# Altium schematic sheet ESP32.SchDoc
size A4
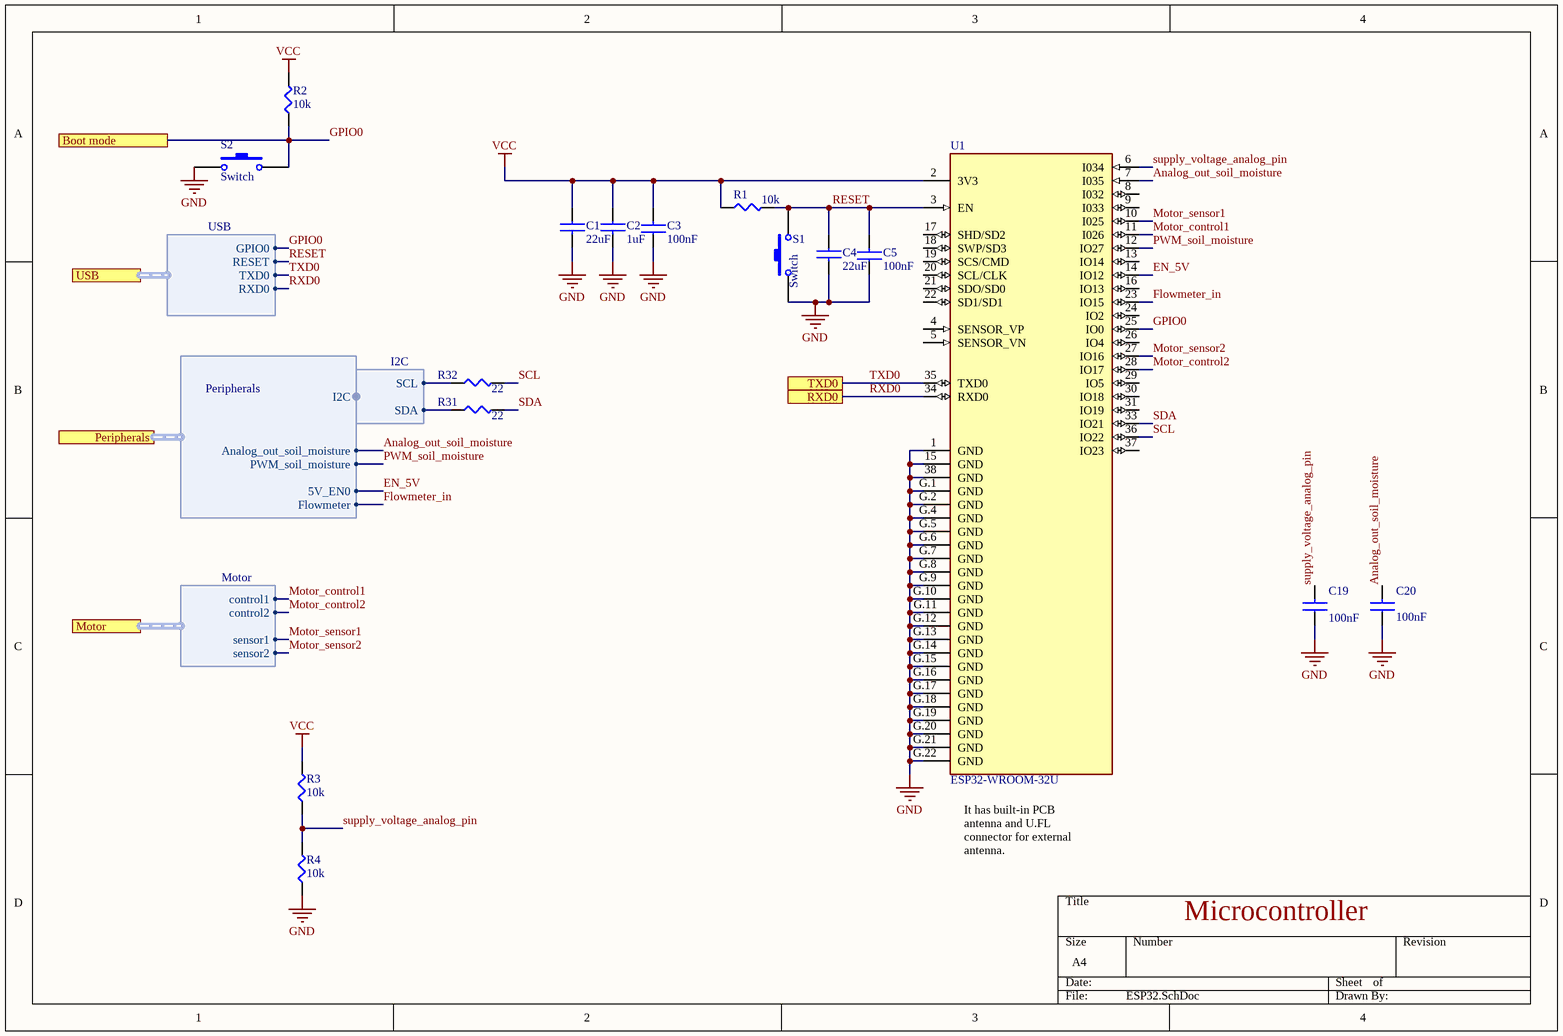
[diagram p0: ESP32.SchDoc]

## Parts
C1  22uF  [CAPC200X125X110L50N]
C2  1uF  [CAPC200X125X110L50N]
C3  100nF  [CAPC160X80X90L35N]
C4  22uF  [CAPC200X125X110L50N]
C5  100nF  [CAPC160X80X90L35N]
C19  100nF  [CAPC160X80X90L35N]
C20  100nF  [CAPC160X80X90L35N]
R1  10k  [RESC200X125X70L40N]
R2  10k  [RESC200X125X70L40N]
R3  10k  [RESC200X125X70L40N]
R4  10k  [RESC200X125X70L40N]
R31  22  [RESC160X80X90L30N]
R32  22  [RESC160X80X90L30N]
S1  Switch  [SKRKAEE020]
S2  Switch  [SKRKAEE020]
U1  ESP32-WROOM-32U  [ESP32-WROOM-32U]

## Ports
Boot mode, Motor (harness Motor), Peripherals (harness Peripherals), RXD0, TXD0, USB (harness USB)

## Harnesses
Motor: control1, control2, sensor1, sensor2
Peripherals: I2C, Analog_out_soil_moisture, PWM_soil_moisture, 5V_EN0, Flowmeter
I2C: SDA, SCL
USB: GPIO0, RESET, TXD0, RXD0

## Nets
GND: C1.2 C2.2 C3.1 C4.2 C5.1 C19.1 C20.1 R4.1 S1.1 S2.2 U1.1(GND) U1.15(GND) U1.38(GND) U1.G.1(GND) U1.G.2(GND) U1.G.4(GND) U1.G.5(GND) U1.G.6(GND) U1.G.7(GND) U1.G.8(GND) U1.G.9(GND) U1.G.10(GND) U1.G.11(GND) U1.G.12(GND) U1.G.13(GND) U1.G.14(GND) U1.G.15(GND) U1.G.16(GND) U1.G.17(GND) U1.G.18(GND) U1.G.19(GND) U1.G.20(GND) U1.G.21(GND) U1.G.22(GND)
VCC: C1.1 C2.1 C3.2 R1.1 R2.2 R3.2 U1.2(3V3)
Analog_out_soil_moisture: C20.2 U1.7(I035) ; port Peripherals.Analog_out_soil_moisture
EN_5V: U1.14(IO12) ; port Peripherals.5V_EN0
Flowmeter_in: U1.23(IO15) ; port Peripherals.Flowmeter
GPIO0: R2.1 S2.1 U1.25(IO0) ; port Boot mode, port USB.GPIO0
Motor_control1: U1.11(I026) ; port Motor.control1
Motor_control2: U1.28(IO17) ; port Motor.control2
Motor_sensor1: U1.10(I025) ; port Motor.sensor1
Motor_sensor2: U1.27(IO16) ; port Motor.sensor2
PWM_soil_moisture: U1.12(IO27) ; port Peripherals.PWM_soil_moisture
RESET: C4.1 C5.2 R1.2 S1.2 U1.3(EN) ; port USB.RESET
RXD0: U1.34(RXD0) ; port RXD0, port USB.RXD0
SCL: R32.2 U1.36(IO22)
SDA: R31.2 U1.33(IO21)
supply_voltage_analog_pin: C19.2 R3.1 R4.2 U1.6(I034)
TXD0: U1.35(TXD0) ; port TXD0, port USB.TXD0
NetR31_1: R31.1 ; harness I2C.SDA
NetR32_1: R32.1 ; harness I2C.SCL

Not connected (* = marked no-connect by the designer): U1 4(SENSOR_VP) 5(SENSOR_VN) 8(I032) 9(I033) 13(IO14) 16(IO13) 17(SHD/SD2) 18(SWP/SD3) 19(SCS/CMD) 20(SCL/CLK) 21(SDO/SD0) 22(SD1/SD1) 24(IO2) 26(IO4) 29(IO5) 30(IO18) 31(IO19) 37(IO23)

## Notes on the sheet
- (near U1) It has built-in PCB antenna and U.FL connector for external antenna.
- Microcontroller

## Library data of the parts
C1-C5 C19 C20 = Capacitor: Part Number: *; Package: *
  C1 C4: Value: 22uF; LCSC Part #: C59461
  C2: Value: 1uF; LCSC Part #: C15849
  C3 C5 C19 C20: Value: 100nF; LCSC Part #: C14663
R1-R4 R31 R32 = Resistor: Part Number: *; Package: *
  R1-R4: Value: 10k; LCSC Part #: C17414
  R31 R32: Value: 22; LCSC Part #: C23345
U1 = ESP32-WROOM-32U: Bluetooth, WiFi 802.11b/g/n, Bluetooth v4.2 +EDR, Class 1, 2 and 3 Transceiver Module 2.4GHz ~ 2.5GHz Antenna Not Included, U.FL Surface Mount; MF: Espressif Systems; Value: *; SnapEDA_Link: https://www.snapeda.com/parts/ESP32-WROOM-32U/Espressif%20Systems/view-part/2472476/?ref=snap; Availability: Unavailable; Price: None; DigiKey-Purchase-URL: https://snapeda.com/shop?store=DigiKey&id=2472476; Package: Module Espressif Systems; MP: ESP32-WROOM-32U; LCSC Part #: C277944
S1 S2 = Switch: Published: 24-Mar-1999; LatestRevisionDate: 17-Jul-2002; LatestRevisionNote: Re-released for DXP Platform.; PackageReference: SPST-2; Publisher: Altium Limited; PackageDescription: Switch; 2 Leads; LCSC Part #: C115357